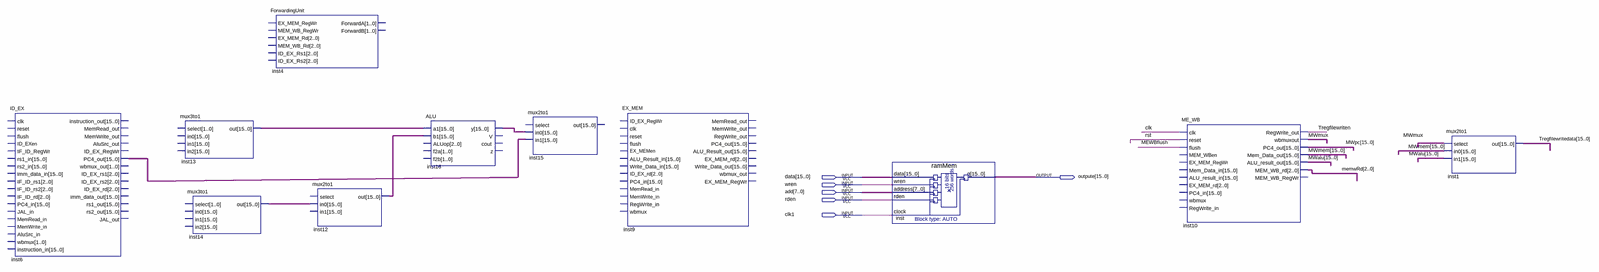
[diagram p0: schematic sheet, whole]
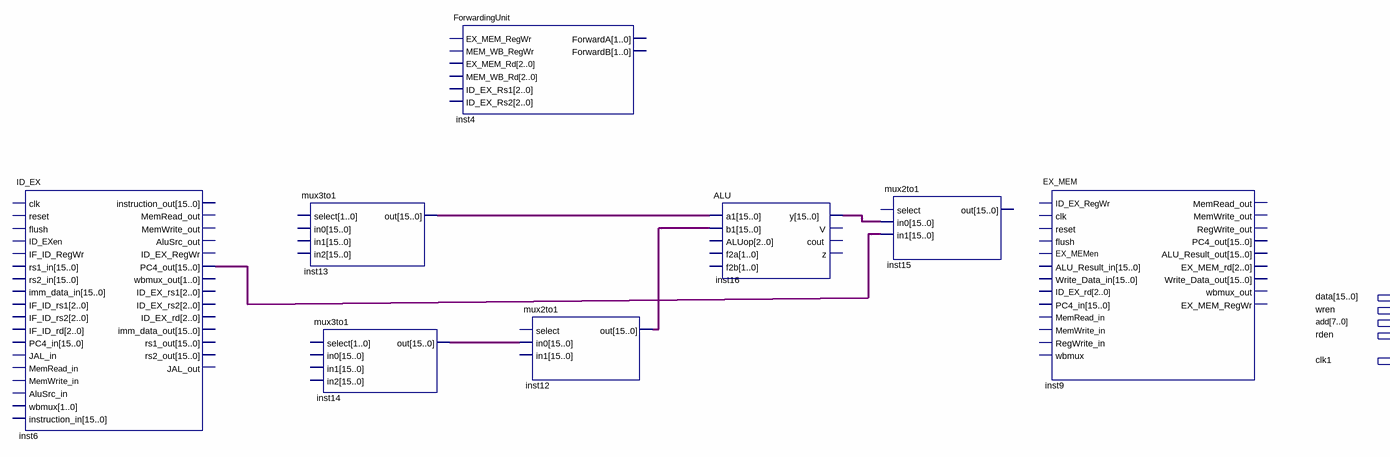
[diagram p1: schematic sheet, left part]
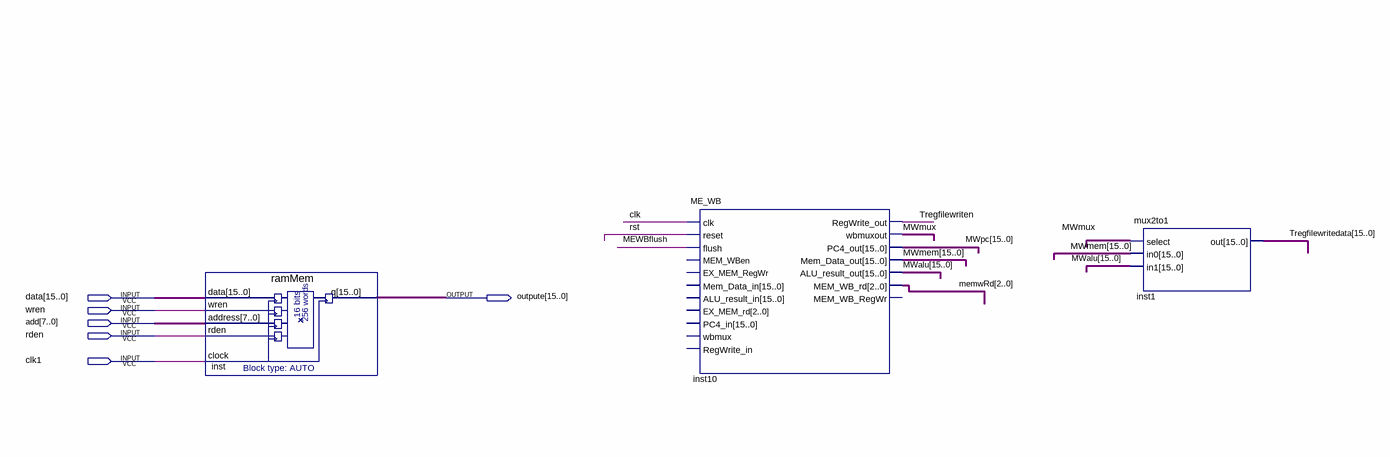
[diagram p2: schematic sheet, right part]
// Quartus schematic joe_simulation.bdf as structural Verilog: 11 symbols, 6 pins
module joe_simulation (
  input  [15:0] data,
  input  wren,
  input  [7:0] add,
  input  rden,
  input  clk1,
  output [15:0] outpute
);

  wire clk, MEWBflush, MWmux, rst, Tregfilewriten;
  wire [2:0] memwRd;
  wire [15:0] inst6_pc4_out, inst12_out, inst13_out, inst14_out, inst16_y, MWalu, MWmem, MWpc,
       Tregfilewritedata;

  ID_EX inst6 (.PC4_out(inst6_pc4_out));  // open: clk, reset, flush, ID_EXen, IF_ID_RegWr, rs1_in, rs2_in, imm_data_in, IF_ID_rs1, IF_ID_rs2, IF_ID_rd, PC4_in, JAL_in, MemRead_in, MemWrite_in, AluSrc_in, wbmux, instruction_in, instruction_out, MemRead_out, MemWrite_out, AluSrc_out, ID_EX_RegWr, wbmux_out, ID_EX_rs1, ID_EX_rs2, ID_EX_rd, imm_data_out, rs1_out, rs2_out, JAL_out
  mux3to1 inst13 (.out(inst13_out));  // open: select, in0, in1, in2
  mux3to1 inst14 (.out(inst14_out));  // open: select, in0, in1, in2
  ForwardingUnit inst4 ();  // open: EX_MEM_RegWr, MEM_WB_RegWr, EX_MEM_Rd, MEM_WB_Rd, ID_EX_Rs1, ID_EX_Rs2, ForwardA, ForwardB
  mux2to1 inst12 (.in0(inst14_out), .out(inst12_out));  // open: select, in1
  ALU inst16 (.a1(inst13_out), .b1(inst12_out), .y(inst16_y));  // open: ALUop, f2a, f2b, V, cout, z
  mux2to1 inst15 (.in0(inst16_y), .in1(inst6_pc4_out));  // open: select, out
  EX_MEM inst9 ();  // open: ID_EX_RegWr, clk, reset, flush, EX_MEMen, ALU_Result_in, Write_Data_in, ID_EX_rd, PC4_in, MemRead_in, MemWrite_in, RegWrite_in, wbmux, MemRead_out, MemWrite_out, RegWrite_out, PC4_out, ALU_Result_out, EX_MEM_rd, Write_Data_out, wbmux_out, EX_MEM_RegWr
  ramMem inst (.data(data), .wren(wren), .address(add), .rden(rden), .clock(clk1), .q(outpute));
  ME_WB inst10 (
    .clk(clk), .reset(rst), .flush(MEWBflush), .RegWrite_out(Tregfilewriten), .wbmuxout(MWmux),
    .PC4_out(MWpc), .Mem_Data_out(MWmem), .ALU_result_out(MWalu), .MEM_WB_rd(memwRd));  // open: MEM_WBen, EX_MEM_RegWr, Mem_Data_in, ALU_result_in, EX_MEM_rd, PC4_in, wbmux, RegWrite_in, MEM_WB_RegWr
  mux2to1 inst1 (.select(MWmux), .in0(MWmem), .in1(MWalu), .out(Tregfilewritedata));
endmodule
